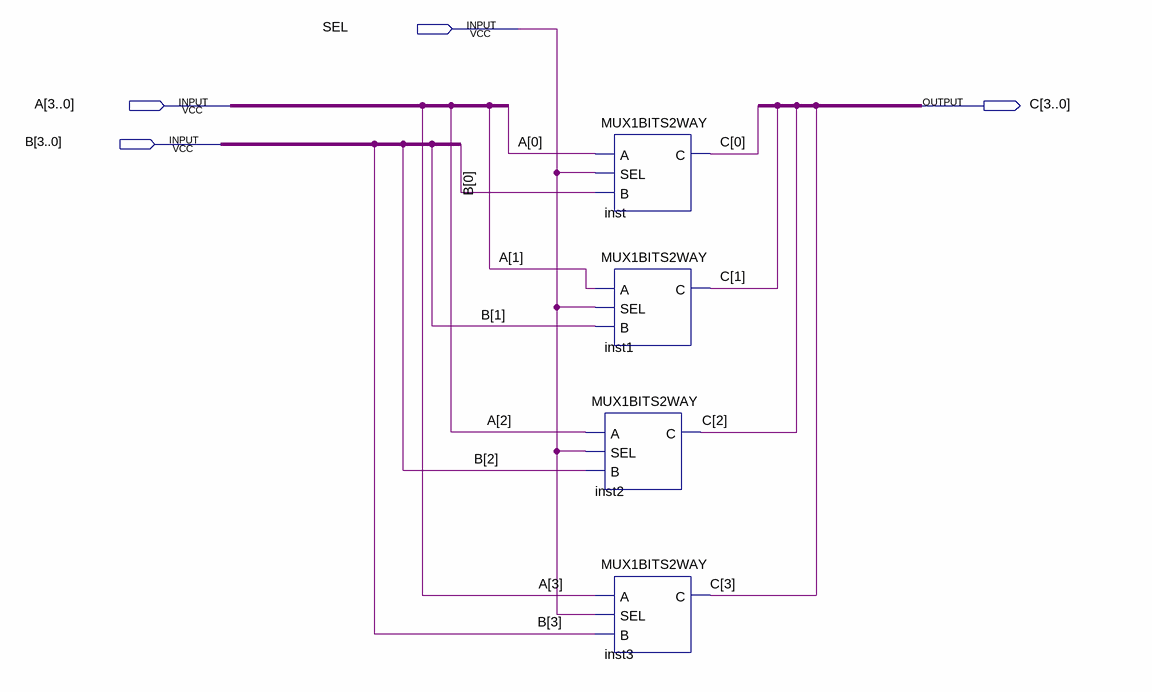
[diagram p0: schematic sheet]
// Quartus schematic MUX_bus.bdf as structural Verilog: 4 symbols, 4 pins
module MUX_bus (
  input  SEL,
  input  [3:0] A,
  input  [3:0] B,
  output [3:0] C
);

  MUX1BITS2WAY inst (.A(A[0]), .SEL(SEL), .B(B[0]), .C(C[0]));
  MUX1BITS2WAY inst1 (.A(A[1]), .SEL(SEL), .B(B[1]), .C(C[1]));
  MUX1BITS2WAY inst2 (.A(A[2]), .SEL(SEL), .B(B[2]), .C(C[2]));
  MUX1BITS2WAY inst3 (.A(A[3]), .SEL(SEL), .B(B[3]), .C(C[3]));
endmodule
